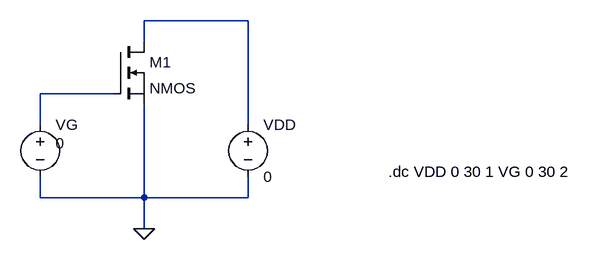
[diagram p0: schematic Draft1.asc]
Draft1.asc, the LTspice schematic file:
Version 4
SHEET 1 1212 680
WIRE 352 48 192 48
WIRE 192 80 192 48
WIRE 144 160 32 160
WIRE 32 208 32 160
WIRE 352 208 352 48
WIRE 32 320 32 288
WIRE 192 320 192 176
WIRE 192 320 32 320
WIRE 352 320 352 288
WIRE 352 320 192 320
WIRE 192 368 192 320
FLAG 192 368 0
SYMBOL nmos 144 80 R0
SYMATTR InstName M1
SYMBOL voltage 32 192 R0
WINDOW 3 24 44 Left 2
WINDOW 123 0 0 Left 0
WINDOW 39 0 0 Left 0
SYMATTR InstName VG
SYMATTR Value 0
SYMBOL voltage 352 192 R0
WINDOW 123 0 0 Left 0
WINDOW 39 0 0 Left 0
SYMATTR InstName VDD
SYMATTR Value 0
TEXT 568 280 Left 2 !.dc VDD 0 30 1 VG 0 30 2

The netlist it stands for:
* Draft1.asc
M1 N001 N002 0 0 NMOS
VG N002 0 0
VDD N001 0 0
.model NMOS NMOS
.model PMOS PMOS
.lib standard.mos
.dc VDD 0 30 1 VG 0 30 2
.backanno
.end